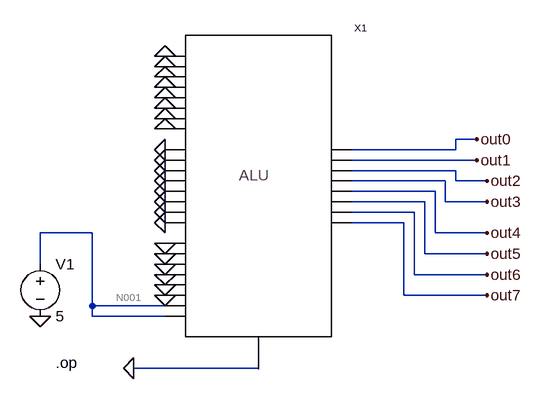
[diagram p0: schematic topEntity.asc]
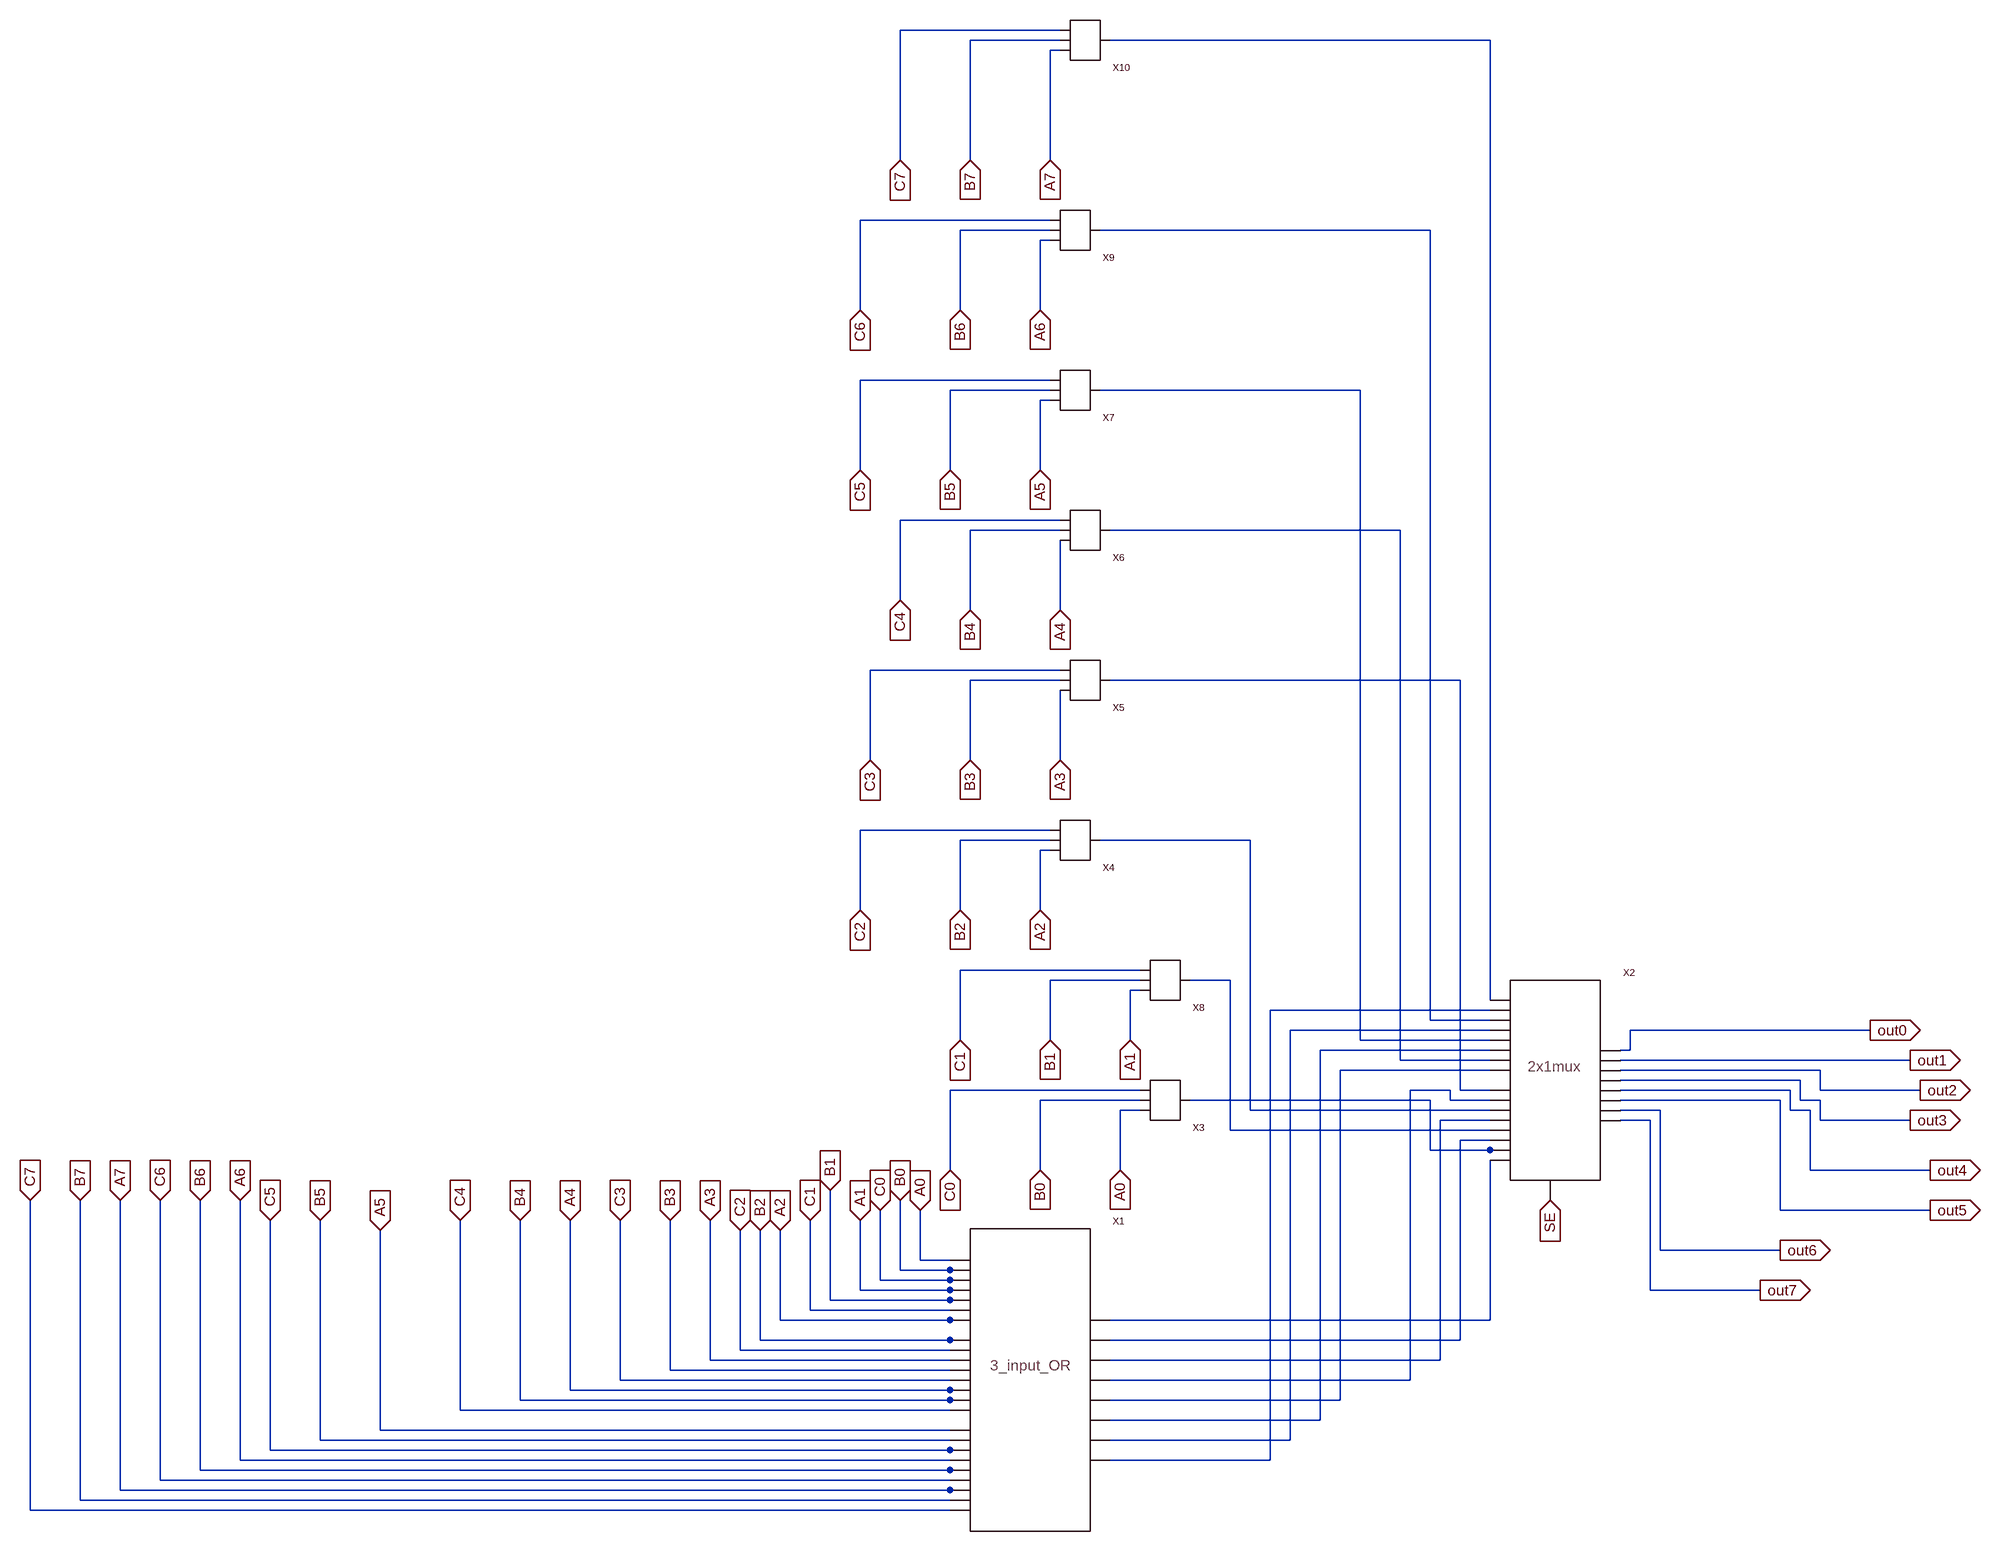
[diagram p1: sub-circuit alu.asc]
topEntity.asc, the LTspice schematic file:
Version 4
SHEET 1 880 680
WIRE 560 112 528 112
WIRE 528 128 528 112
WIRE 528 128 368 128
WIRE 560 144 368 144
WIRE 528 160 368 160
WIRE 512 176 368 176
WIRE 528 176 528 160
WIRE 576 176 528 176
WIRE 496 192 368 192
WIRE 480 208 368 208
WIRE 512 208 512 176
WIRE 576 208 512 208
WIRE 464 224 368 224
WIRE 448 240 368 240
WIRE -32 256 -112 256
WIRE 496 256 496 192
WIRE 576 256 496 256
WIRE 480 288 480 208
WIRE 576 288 480 288
WIRE -112 304 -112 256
WIRE 464 320 464 224
WIRE 576 320 464 320
WIRE 448 352 448 240
WIRE 576 352 448 352
WIRE -32 368 -32 256
WIRE 80 368 -32 368
WIRE -32 384 -32 368
WIRE 80 384 -32 384
WIRE 224 464 32 464
FLAG 80 -16 0
FLAG 80 0 0
FLAG 80 16 0
FLAG 80 32 0
FLAG 80 48 0
FLAG 80 64 0
FLAG 80 80 0
FLAG 80 96 0
FLAG 80 128 0
FLAG 80 144 0
FLAG 80 160 0
FLAG 80 176 0
FLAG 80 192 0
FLAG 80 208 0
FLAG 80 224 0
FLAG 80 240 0
FLAG 80 272 0
FLAG 80 288 0
FLAG 80 304 0
FLAG 80 320 0
FLAG 80 336 0
FLAG 80 352 0
FLAG -112 384 0
FLAG 560 112 out0
FLAG 560 144 out1
FLAG 576 176 out2
FLAG 576 208 out3
FLAG 576 256 out4
FLAG 576 288 out5
FLAG 576 320 out6
FLAG 576 352 out7
FLAG 32 464 0
SYMBOL ALU 544 160 R0
SYMATTR InstName X1
SYMBOL voltage -112 288 R0
SYMATTR InstName V1
SYMATTR Value 5
TEXT -88 456 Left 2 !.op

alu.asc, the sub-circuit schematic file:
Version 4
SHEET 1 1052 2052
WIRE -544 -592 -800 -592
WIRE -544 -576 -688 -576
WIRE 144 -576 -464 -576
WIRE -544 -560 -560 -560
WIRE -800 -384 -800 -592
WIRE -688 -384 -688 -576
WIRE -560 -384 -560 -560
WIRE -560 -288 -864 -288
WIRE -560 -272 -704 -272
WIRE 48 -272 -480 -272
WIRE -560 -256 -576 -256
WIRE -864 -144 -864 -288
WIRE -704 -144 -704 -272
WIRE -576 -144 -576 -256
WIRE -560 -32 -864 -32
WIRE -560 -16 -720 -16
WIRE -64 -16 -480 -16
WIRE -560 0 -576 0
WIRE -864 112 -864 -32
WIRE -720 112 -720 -16
WIRE -576 112 -576 0
WIRE -544 192 -800 192
WIRE -544 208 -688 208
WIRE 0 208 -464 208
WIRE -800 320 -800 192
WIRE -688 336 -688 208
WIRE -544 336 -544 224
WIRE -544 432 -848 432
WIRE -544 448 -688 448
WIRE 96 448 -464 448
WIRE -848 576 -848 432
WIRE -688 576 -688 448
WIRE -544 576 -544 464
WIRE -560 688 -864 688
WIRE -560 704 -704 704
WIRE -240 704 -480 704
WIRE -560 720 -576 720
WIRE -864 816 -864 688
WIRE -704 816 -704 704
WIRE -576 816 -576 720
WIRE -416 912 -704 912
WIRE -416 928 -560 928
WIRE -272 928 -336 928
WIRE -416 944 -432 944
WIRE 144 960 144 -576
WIRE 144 976 -208 976
WIRE 48 992 48 -272
WIRE 144 992 48 992
WIRE 144 1008 -176 1008
WIRE 752 1008 368 1008
WIRE -704 1024 -704 912
WIRE -560 1024 -560 928
WIRE -432 1024 -432 944
WIRE -64 1024 -64 -16
WIRE 144 1024 -64 1024
WIRE 144 1040 -128 1040
WIRE 368 1040 368 1008
WIRE 368 1040 352 1040
WIRE 0 1056 0 208
WIRE 144 1056 0 1056
WIRE 816 1056 352 1056
WIRE 144 1072 -96 1072
WIRE 672 1072 352 1072
WIRE 640 1088 352 1088
WIRE -416 1104 -720 1104
WIRE 80 1104 16 1104
WIRE 96 1104 96 448
WIRE 144 1104 96 1104
WIRE 624 1104 352 1104
WIRE 672 1104 672 1072
WIRE 832 1104 672 1104
WIRE -416 1120 -576 1120
WIRE 48 1120 -336 1120
WIRE 80 1120 80 1104
WIRE 144 1120 80 1120
WIRE 608 1120 352 1120
WIRE 640 1120 640 1088
WIRE 672 1120 640 1120
WIRE -416 1136 -448 1136
WIRE -240 1136 -240 704
WIRE 144 1136 -240 1136
WIRE 416 1136 352 1136
WIRE 624 1136 624 1104
WIRE 656 1136 624 1136
WIRE 144 1152 64 1152
WIRE 400 1152 352 1152
WIRE 672 1152 672 1120
WIRE 816 1152 672 1152
WIRE -272 1168 -272 928
WIRE 144 1168 -272 1168
WIRE 144 1184 96 1184
WIRE 48 1200 48 1120
WIRE 144 1200 48 1200
WIRE 160 1200 144 1200
WIRE -720 1232 -720 1104
WIRE -576 1232 -576 1120
WIRE -448 1232 -448 1136
WIRE 656 1232 656 1136
WIRE 848 1232 656 1232
WIRE 608 1296 608 1120
WIRE 848 1296 608 1296
WIRE 416 1360 416 1136
WIRE 608 1360 416 1360
WIRE -768 1376 -768 1296
WIRE -720 1376 -768 1376
WIRE -800 1392 -800 1280
WIRE -720 1392 -800 1392
WIRE -704 1392 -720 1392
WIRE -832 1408 -832 1296
WIRE -720 1408 -832 1408
WIRE -704 1408 -720 1408
WIRE -864 1424 -864 1312
WIRE -720 1424 -864 1424
WIRE -704 1424 -720 1424
WIRE 400 1424 400 1152
WIRE 576 1424 400 1424
WIRE -912 1440 -912 1264
WIRE -720 1440 -912 1440
WIRE -704 1440 -720 1440
WIRE -944 1456 -944 1312
WIRE -720 1456 -944 1456
WIRE -992 1472 -992 1328
WIRE -720 1472 -992 1472
WIRE -688 1472 -720 1472
WIRE 144 1472 144 1216
WIRE 144 1472 -464 1472
WIRE -1024 1504 -1024 1328
WIRE -720 1504 -1024 1504
WIRE -704 1504 -720 1504
WIRE 96 1504 96 1184
WIRE 96 1504 -464 1504
WIRE -1056 1520 -1056 1328
WIRE -720 1520 -1056 1520
WIRE -1104 1536 -1104 1312
WIRE -720 1536 -1104 1536
WIRE 64 1536 64 1152
WIRE 64 1536 -464 1536
WIRE -1168 1552 -1168 1312
WIRE -720 1552 -1168 1552
WIRE -1248 1568 -1248 1312
WIRE -720 1568 -1248 1568
WIRE 16 1568 16 1104
WIRE 16 1568 -464 1568
WIRE -1328 1584 -1328 1312
WIRE -720 1584 -1328 1584
WIRE -704 1584 -720 1584
WIRE -1408 1600 -1408 1312
WIRE -720 1600 -1408 1600
WIRE -704 1600 -720 1600
WIRE -96 1600 -96 1072
WIRE -96 1600 -464 1600
WIRE -1504 1616 -1504 1312
WIRE -720 1616 -1504 1616
WIRE -128 1632 -128 1040
WIRE -128 1632 -464 1632
WIRE -1632 1648 -1632 1328
WIRE -720 1648 -1632 1648
WIRE -1728 1664 -1728 1312
WIRE -720 1664 -1728 1664
WIRE -176 1664 -176 1008
WIRE -176 1664 -464 1664
WIRE -1808 1680 -1808 1312
WIRE -720 1680 -1808 1680
WIRE -704 1680 -720 1680
WIRE -1856 1696 -1856 1280
WIRE -720 1696 -1856 1696
WIRE -208 1696 -208 976
WIRE -208 1696 -464 1696
WIRE -1920 1712 -1920 1280
WIRE -720 1712 -1920 1712
WIRE -704 1712 -720 1712
WIRE -1984 1728 -1984 1280
WIRE -720 1728 -1984 1728
WIRE -2048 1744 -2048 1280
WIRE -720 1744 -2048 1744
WIRE -704 1744 -720 1744
WIRE -2112 1760 -2112 1280
WIRE -720 1760 -2112 1760
WIRE -2192 1776 -2192 1280
WIRE -720 1776 -2192 1776
FLAG -800 -384 C7
IOPIN -800 -384 In
FLAG -864 -144 C6
IOPIN -864 -144 In
FLAG -864 112 C5
IOPIN -864 112 In
FLAG -800 320 C4
IOPIN -800 320 In
FLAG -848 576 C3
IOPIN -848 576 In
FLAG -864 816 C2
IOPIN -864 816 In
FLAG -704 1024 C1
IOPIN -704 1024 In
FLAG -720 1232 C0
IOPIN -720 1232 In
FLAG -688 -384 B7
IOPIN -688 -384 In
FLAG -560 -384 A7
IOPIN -560 -384 In
FLAG -704 -144 B6
IOPIN -704 -144 In
FLAG -576 -144 A6
IOPIN -576 -144 In
FLAG -720 112 B5
IOPIN -720 112 In
FLAG -576 112 A5
IOPIN -576 112 In
FLAG -688 336 B4
IOPIN -688 336 In
FLAG -544 336 A4
IOPIN -544 336 In
FLAG -688 576 B3
IOPIN -688 576 In
FLAG -544 576 A3
IOPIN -544 576 In
FLAG -704 816 B2
IOPIN -704 816 In
FLAG -576 816 A2
IOPIN -576 816 In
FLAG -560 1024 B1
IOPIN -560 1024 In
FLAG -432 1024 A1
IOPIN -432 1024 In
FLAG -576 1232 B0
IOPIN -576 1232 In
FLAG -448 1232 A0
IOPIN -448 1232 In
FLAG -832 1296 C0
IOPIN -832 1296 In
FLAG -800 1280 B0
IOPIN -800 1280 In
FLAG -768 1296 A0
IOPIN -768 1296 In
FLAG -944 1312 C1
IOPIN -944 1312 In
FLAG -912 1264 B1
IOPIN -912 1264 In
FLAG -864 1312 A1
IOPIN -864 1312 In
FLAG -1056 1328 C2
IOPIN -1056 1328 In
FLAG -1024 1328 B2
IOPIN -1024 1328 In
FLAG -992 1328 A2
IOPIN -992 1328 In
FLAG -1248 1312 C3
IOPIN -1248 1312 In
FLAG -1168 1312 B3
IOPIN -1168 1312 In
FLAG -1104 1312 A3
IOPIN -1104 1312 In
FLAG -1504 1312 C4
IOPIN -1504 1312 In
FLAG -1408 1312 B4
IOPIN -1408 1312 In
FLAG -1328 1312 A4
IOPIN -1328 1312 In
FLAG -1808 1312 C5
IOPIN -1808 1312 In
FLAG -1728 1312 B5
IOPIN -1728 1312 In
FLAG -1632 1328 A5
IOPIN -1632 1328 In
FLAG -1984 1280 C6
IOPIN -1984 1280 In
FLAG -1920 1280 B6
IOPIN -1920 1280 In
FLAG -1856 1280 A6
IOPIN -1856 1280 In
FLAG -2192 1280 C7
IOPIN -2192 1280 In
FLAG -2112 1280 B7
IOPIN -2112 1280 In
FLAG -2048 1280 A7
IOPIN -2048 1280 In
FLAG 752 1008 out0
IOPIN 752 1008 Out
FLAG 816 1056 out1
IOPIN 816 1056 Out
FLAG 832 1104 out2
IOPIN 832 1104 Out
FLAG 816 1152 out3
IOPIN 816 1152 Out
FLAG 848 1232 out4
IOPIN 848 1232 Out
FLAG 848 1296 out5
IOPIN 848 1296 Out
FLAG 608 1360 out6
IOPIN 608 1360 Out
FLAG 576 1424 out7
IOPIN 576 1424 Out
FLAG 240 1280 SE
IOPIN 240 1280 In
SYMBOL MUX_8input 560 1104 R0
SYMATTR InstName X2
SYMBOL XOP_Part1 -304 1088 M180
SYMATTR InstName X3
SYMBOL XOP_Part1 -448 672 M180
SYMATTR InstName X4
SYMBOL XOP_Part1 -432 416 M180
SYMATTR InstName X5
SYMBOL XOP_Part1 -432 176 M180
SYMATTR InstName X6
SYMBOL XOP_Part1 -448 -48 M180
SYMATTR InstName X7
SYMBOL XOP_Part1 -304 896 M180
SYMATTR InstName X8
SYMBOL XOP_Part1 -448 -304 M180
SYMATTR InstName X9
SYMBOL XOP_Part1 -432 -608 M180
SYMATTR InstName X10
SYMBOL 8bit_OR -336 1472 R0
SYMATTR InstName X1

The netlist it stands for:
* topEntity.asc
XX1 0 0 0 0 0 0 0 0 0 0 0 0 0 0 0 N001 0 0 0 0 0 0 0 N001 out1 out0 out2 out3 out4 out5 out6 out7 0 alu
V1 N001 0 5

* block symbol definitions
.subckt alu A0 A1 A2 A3 A4 A5 A6 A7 B0 B1 B2 B3 B4 B5 B6 B7 C0 C1 C2 C3 C4 C5 C6 C7 out1 out0 out2 out3 out4 out5 out6 out7 SE
XX2 N001 N008 N002 N009 N003 N010 N004 N011 N005 N012 N006 N014 N007 N015 N013 N016 out0 out1 out2 out3 out4 out5 out6 out7 SE MUX_8input  ; pins in1 in2 in3 in4 in5 in6 in7 in8 in9 in10 in11 in12 in13 in14 in15 in16 y0 y1 y2 y3 y4 y5 y6 y7 s
XX3 A0 B0 C0 N013 XOP_Part1  ; pins A B C Y
XX4 A2 B2 C2 N006 XOP_Part1  ; pins A B C Y
XX5 A3 B3 C3 N005 XOP_Part1  ; pins A B C Y
XX6 A4 B4 C4 N004 XOP_Part1  ; pins A B C Y
XX7 A5 B5 C5 N003 XOP_Part1  ; pins A B C Y
XX8 A1 B1 C1 N007 XOP_Part1  ; pins A B C Y
XX9 A6 B6 C6 N002 XOP_Part1  ; pins A B C Y
XX10 A7 B7 C7 N001 XOP_Part1  ; pins A B C Y
XX1 A0 B0 C0 A1 B1 C1 A2 B2 C2 A3 B3 C3 A4 B4 C4 A5 B5 C5 A6 B6 C6 A7 B7 C7 N016 N015 N014 N012 N011 N010 N009 N008 8bit_OR  ; pins A0 B0 C0 A1 B1 C1 A2 B2 C2 A3 B3 C3 A4 B4 C4 A5 B5 C5 A6 B6 C6 A7 B7 C7 Y0 Y1 Y2 Y3 Y4 Y5 Y6 Y7
.ends alu

.op
.backanno
.end

* Results of the author's LTspice run, read from the files saved beside the schematic
* Operating Point:
*   V(out7) = 450.7 nV
*   V(out6) = 450.7 nV
*   V(out5) = 450.7 nV
*   V(out4) = 450.7 nV
*   V(out3) = 450.7 nV
*   V(out2) = 450.7 nV
*   V(out1) = 450.7 nV
*   V(out0) = 1.251 µV
*   V(n001) = 5 V
*   I(V1) = -40.04 pA
* From the log:
*   Semiconductor Device Operating Points:
*                           --- MOSFET Transistors ---
*   Name:      m:x1:x1:x8:7 m:x1:x1:x8:6 m:x1:x1:x8:5 m:x1:x1:x8:4 m:x1:x1:x7:7
*   Model:         nmos         nmos         nmos         nmos         nmos
*   Id:          1.00e-11     5.98e-20     2.50e-12     2.50e-12     1.50e-11
*   Vgs:         2.50e-08     0.00e+00     5.00e+00     5.00e+00     5.00e+00
*   Vds:         5.00e+00     2.50e-08     2.50e-08     2.50e-08     1.50e-07
*   Vbs:         0.00e+00     0.00e+00     0.00e+00     0.00e+00     0.00e+00
*   Vth:         0.00e+00     0.00e+00     0.00e+00     0.00e+00     0.00e+00
*   Vdsat:       2.50e-08     0.00e+00     5.00e+00     5.00e+00     5.00e+00
*   Gm:          5.01e-13     0.00e+00     5.01e-13     5.01e-13     3.00e-12
*   Gds:         0.00e+00     0.00e+00     1.00e-04     1.00e-04     1.00e-04
*   Gmb:         0.00e+00     0.00e+00     0.00e+00     0.00e+00     0.00e+00
*   Cbd:         0.00e+00     0.00e+00     0.00e+00     0.00e+00     0.00e+00
*   Cbs:         0.00e+00     0.00e+00     0.00e+00     0.00e+00     0.00e+00
*   Cgsov:       0.00e+00     0.00e+00     0.00e+00     0.00e+00     0.00e+00
*   Cgdov:       0.00e+00     0.00e+00     0.00e+00     0.00e+00     0.00e+00
*   Cgbov:       0.00e+00     0.00e+00     0.00e+00     0.00e+00     0.00e+00
*   Cgs:         0.00e+00     0.00e+00     0.00e+00     0.00e+00     0.00e+00
*   Cgd:         0.00e+00     0.00e+00     0.00e+00     0.00e+00     0.00e+00
*   Cgb:         0.00e+00    -0.00e+00     0.00e+00     0.00e+00     0.00e+00
*   Name:      m:x1:x1:x7:6 m:x1:x1:x7:5 m:x1:x1:x7:4 m:x1:x1:x6:7 m:x1:x1:x6:6
*   Model:         nmos         nmos         nmos         nmos         nmos
*   Id:          1.00e-11     1.00e-11     1.00e-11     1.50e-11     1.00e-11
*   Vgs:         0.00e+00     0.00e+00     0.00e+00     5.00e+00     0.00e+00
*   Vds:         5.00e+00     5.00e+00     5.00e+00     1.50e-07     5.00e+00
*   Vbs:         0.00e+00     0.00e+00     0.00e+00     0.00e+00     0.00e+00
*   Vth:         0.00e+00     0.00e+00     0.00e+00     0.00e+00     0.00e+00
*   Vdsat:       0.00e+00     0.00e+00     0.00e+00     5.00e+00     0.00e+00
*   Gm:          0.00e+00     0.00e+00     0.00e+00     3.00e-12     0.00e+00
*   Gds:         0.00e+00     0.00e+00     0.00e+00     1.00e-04     0.00e+00
*   Gmb:         0.00e+00     0.00e+00     0.00e+00     0.00e+00     0.00e+00
*   Cbd:         0.00e+00     0.00e+00     0.00e+00     0.00e+00     0.00e+00
*   Cbs:         0.00e+00     0.00e+00     0.00e+00     0.00e+00     0.00e+00
*   Cgsov:       0.00e+00     0.00e+00     0.00e+00     0.00e+00     0.00e+00
*   Cgdov:       0.00e+00     0.00e+00     0.00e+00     0.00e+00     0.00e+00
*   Cgbov:       0.00e+00     0.00e+00     0.00e+00     0.00e+00     0.00e+00
*   Cgs:         0.00e+00     0.00e+00     0.00e+00     0.00e+00     0.00e+00
*   Cgd:         0.00e+00     0.00e+00     0.00e+00     0.00e+00     0.00e+00
*   Cgb:        -0.00e+00    -0.00e+00    -0.00e+00     0.00e+00    -0.00e+00
*   Name:      m:x1:x1:x6:5 m:x1:x1:x6:4 m:x1:x1:x5:7 m:x1:x1:x5:6 m:x1:x1:x5:5
*   Model:         nmos         nmos         nmos         nmos         nmos
*   Id:          1.00e-11     1.00e-11     1.50e-11     1.00e-11     1.00e-11
*   Vgs:         0.00e+00     0.00e+00     5.00e+00     0.00e+00     0.00e+00
*   Vds:         5.00e+00     5.00e+00     1.50e-07     5.00e+00     5.00e+00
*   Vbs:         0.00e+00     0.00e+00     0.00e+00     0.00e+00     0.00e+00
*   Vth:         0.00e+00     0.00e+00     0.00e+00     0.00e+00     0.00e+00
*   Vdsat:       0.00e+00     0.00e+00     5.00e+00     0.00e+00     0.00e+00
*   Gm:          0.00e+00     0.00e+00     3.00e-12     0.00e+00     0.00e+00
*   Gds:         0.00e+00     0.00e+00     1.00e-04     0.00e+00     0.00e+00
*   Gmb:         0.00e+00     0.00e+00     0.00e+00     0.00e+00     0.00e+00
*   Cbd:         0.00e+00     0.00e+00     0.00e+00     0.00e+00     0.00e+00
*   Cbs:         0.00e+00     0.00e+00     0.00e+00     0.00e+00     0.00e+00
*   Cgsov:       0.00e+00     0.00e+00     0.00e+00     0.00e+00     0.00e+00
*   Cgdov:       0.00e+00     0.00e+00     0.00e+00     0.00e+00     0.00e+00
*   Cgbov:       0.00e+00     0.00e+00     0.00e+00     0.00e+00     0.00e+00
*   Cgs:         0.00e+00     0.00e+00     0.00e+00     0.00e+00     0.00e+00
*   Cgd:         0.00e+00     0.00e+00     0.00e+00     0.00e+00     0.00e+00
*   Cgb:        -0.00e+00    -0.00e+00     0.00e+00    -0.00e+00    -0.00e+00
*   Name:      m:x1:x1:x5:4 m:x1:x1:x4:7 m:x1:x1:x4:6 m:x1:x1:x4:5 m:x1:x1:x4:4
*   Model:         nmos         nmos         nmos         nmos         nmos
*   Id:          1.00e-11     1.50e-11     1.00e-11     1.00e-11     1.00e-11
*   Vgs:         0.00e+00     5.00e+00     0.00e+00     0.00e+00     0.00e+00
*   Vds:         5.00e+00     1.50e-07     5.00e+00     5.00e+00     5.00e+00
*   Vbs:         0.00e+00     0.00e+00     0.00e+00     0.00e+00     0.00e+00
*   Vth:         0.00e+00     0.00e+00     0.00e+00     0.00e+00     0.00e+00
*   Vdsat:       0.00e+00     5.00e+00     0.00e+00     0.00e+00     0.00e+00
*   Gm:          0.00e+00     3.00e-12     0.00e+00     0.00e+00     0.00e+00
*   Gds:         0.00e+00     1.00e-04     0.00e+00     0.00e+00     0.00e+00
*   Gmb:         0.00e+00     0.00e+00     0.00e+00     0.00e+00     0.00e+00
*   Cbd:         0.00e+00     0.00e+00     0.00e+00     0.00e+00     0.00e+00
*   Cbs:         0.00e+00     0.00e+00     0.00e+00     0.00e+00     0.00e+00
*   Cgsov:       0.00e+00     0.00e+00     0.00e+00     0.00e+00     0.00e+00
*   Cgdov:       0.00e+00     0.00e+00     0.00e+00     0.00e+00     0.00e+00
*   Cgbov:       0.00e+00     0.00e+00     0.00e+00     0.00e+00     0.00e+00
*   Cgs:         0.00e+00     0.00e+00     0.00e+00     0.00e+00     0.00e+00
*   Cgd:         0.00e+00     0.00e+00     0.00e+00     0.00e+00     0.00e+00
*   Cgb:        -0.00e+00     0.00e+00    -0.00e+00    -0.00e+00    -0.00e+00
*   Name:      m:x1:x1:x3:7 m:x1:x1:x3:6 m:x1:x1:x3:5 m:x1:x1:x3:4 m:x1:x1:x2:7
*   Model:         nmos         nmos         nmos         nmos         nmos
*   Id:          1.50e-11     1.00e-11     1.00e-11     1.00e-11     1.50e-11
*   Vgs:         5.00e+00     0.00e+00     0.00e+00     0.00e+00     5.00e+00
*   Vds:         1.50e-07     5.00e+00     5.00e+00     5.00e+00     1.50e-07
*   Vbs:         0.00e+00     0.00e+00     0.00e+00     0.00e+00     0.00e+00
*   Vth:         0.00e+00     0.00e+00     0.00e+00     0.00e+00     0.00e+00
*   Vdsat:       5.00e+00     0.00e+00     0.00e+00     0.00e+00     5.00e+00
*   Gm:          3.00e-12     0.00e+00     0.00e+00     0.00e+00     3.00e-12
*   Gds:         1.00e-04     0.00e+00     0.00e+00     0.00e+00     1.00e-04
*   Gmb:         0.00e+00     0.00e+00     0.00e+00     0.00e+00     0.00e+00
*   Cbd:         0.00e+00     0.00e+00     0.00e+00     0.00e+00     0.00e+00
*   Cbs:         0.00e+00     0.00e+00     0.00e+00     0.00e+00     0.00e+00
*   Cgsov:       0.00e+00     0.00e+00     0.00e+00     0.00e+00     0.00e+00
*   Cgdov:       0.00e+00     0.00e+00     0.00e+00     0.00e+00     0.00e+00
*   Cgbov:       0.00e+00     0.00e+00     0.00e+00     0.00e+00     0.00e+00
*   Cgs:         0.00e+00     0.00e+00     0.00e+00     0.00e+00     0.00e+00
*   Cgd:         0.00e+00     0.00e+00     0.00e+00     0.00e+00     0.00e+00
*   Cgb:         0.00e+00    -0.00e+00    -0.00e+00    -0.00e+00     0.00e+00
*   Name:      m:x1:x1:x2:6 m:x1:x1:x2:5 m:x1:x1:x2:4 m:x1:x1:x1:7 m:x1:x1:x1:6
*   Model:         nmos         nmos         nmos         nmos         nmos
*   Id:          1.00e-11     1.00e-11     1.00e-11     1.50e-11     1.00e-11
*   Vgs:         0.00e+00     0.00e+00     0.00e+00     5.00e+00     0.00e+00
*   Vds:         5.00e+00     5.00e+00     5.00e+00     1.50e-07     5.00e+00
*   Vbs:         0.00e+00     0.00e+00     0.00e+00     0.00e+00     0.00e+00
*   Vth:         0.00e+00     0.00e+00     0.00e+00     0.00e+00     0.00e+00
*   Vdsat:       0.00e+00     0.00e+00     0.00e+00     5.00e+00     0.00e+00
*   Gm:          0.00e+00     0.00e+00     0.00e+00     3.00e-12     0.00e+00
*   Gds:         0.00e+00     0.00e+00     0.00e+00     1.00e-04     0.00e+00
*   Gmb:         0.00e+00     0.00e+00     0.00e+00     0.00e+00     0.00e+00
*   Cbd:         0.00e+00     0.00e+00     0.00e+00     0.00e+00     0.00e+00
*   Cbs:         0.00e+00     0.00e+00     0.00e+00     0.00e+00     0.00e+00
*   Cgsov:       0.00e+00     0.00e+00     0.00e+00     0.00e+00     0.00e+00
*   Cgdov:       0.00e+00     0.00e+00     0.00e+00     0.00e+00     0.00e+00
*   Cgbov:       0.00e+00     0.00e+00     0.00e+00     0.00e+00     0.00e+00
*   Cgs:         0.00e+00     0.00e+00     0.00e+00     0.00e+00     0.00e+00
*   Cgd:         0.00e+00     0.00e+00     0.00e+00     0.00e+00     0.00e+00
*   Cgb:        -0.00e+00    -0.00e+00    -0.00e+00     0.00e+00    -0.00e+00
*   Name:      m:x1:x1:x1:5 m:x1:x1:x1:4 m:x1:x10:16 m:x1:x10:15 m:x1:x10:11
*   Model:         nmos         nmos        nmos        nmos        nmos
*   Id:          1.00e-11     1.00e-11    -4.50e-11    1.00e-11    6.01e-11
*   Vgs:         0.00e+00     0.00e+00     5.00e+00   -9.51e-07    5.00e+00
*   Vds:         5.00e+00     5.00e+00    -4.50e-07    5.00e+00    6.01e-07
*   Vbs:         0.00e+00     0.00e+00    -1.05e-06   -1.05e-06    0.00e+00
*   Vth:         0.00e+00     0.00e+00     0.00e+00    0.00e+00    0.00e+00
*   Vdsat:       0.00e+00     0.00e+00     5.00e+00    0.00e+00    5.00e+00
*   Gm:          0.00e+00     0.00e+00     9.01e-12    0.00e+00    1.20e-11
*   Gds:         0.00e+00     0.00e+00     1.00e-04    0.00e+00    1.00e-04
*   Gmb:         0.00e+00     0.00e+00     0.00e+00    0.00e+00    0.00e+00
*   Cbd:         0.00e+00     0.00e+00     0.00e+00    0.00e+00    0.00e+00
*   Cbs:         0.00e+00     0.00e+00     0.00e+00    0.00e+00    0.00e+00
*   Cgsov:       0.00e+00     0.00e+00     0.00e+00    0.00e+00    0.00e+00
*   Cgdov:       0.00e+00     0.00e+00     0.00e+00    0.00e+00    0.00e+00
*   Cgbov:       0.00e+00     0.00e+00     0.00e+00    0.00e+00    0.00e+00
*   Cgs:         0.00e+00     0.00e+00     0.00e+00    0.00e+00    0.00e+00
*   Cgd:         0.00e+00     0.00e+00     0.00e+00    0.00e+00    0.00e+00
*   Cgb:        -0.00e+00    -0.00e+00     0.00e+00    0.00e+00    0.00e+00
*   Name:      m:x1:x10:8  m:x1:x10:9  m:x1:x10:6  m:x1:x10:3  m:x1:x10:1
*   Model:        nmos        nmos        nmos        nmos        nmos
*   Id:          1.00e-11   -5.00e-12    5.01e-12    2.50e-11    1.00e-11
*   Vgs:         5.00e+00   -5.00e+00    1.00e-07    5.00e+00    0.00e+00
*   Vds:         1.00e-07   -5.00e+00    2.00e-07    2.50e-07    5.00e+00
*   Vbs:         0.00e+00   -5.00e+00   -5.00e+00    0.00e+00    0.00e+00
*   Vth:         0.00e+00    0.00e+00    0.00e+00    0.00e+00    0.00e+00
*   Vdsat:       5.00e+00    0.00e+00    1.00e-07    5.00e+00    0.00e+00
*   Gm:          2.00e-12    0.00e+00    2.00e-12    5.00e-12    0.00e+00
*   Gds:         1.00e-04    0.00e+00    0.00e+00    1.00e-04    0.00e+00
*   Gmb:         0.00e+00    0.00e+00    0.00e+00    0.00e+00    0.00e+00
*   Cbd:         0.00e+00    0.00e+00    0.00e+00    0.00e+00    0.00e+00
*   Cbs:         0.00e+00    0.00e+00    0.00e+00    0.00e+00    0.00e+00
*   Cgsov:       0.00e+00    0.00e+00    0.00e+00    0.00e+00    0.00e+00
*   Cgdov:       0.00e+00    0.00e+00    0.00e+00    0.00e+00    0.00e+00
*   Cgbov:       0.00e+00    0.00e+00    0.00e+00    0.00e+00    0.00e+00
*   Cgs:         0.00e+00    0.00e+00    0.00e+00    0.00e+00    0.00e+00
*   Cgd:         0.00e+00    0.00e+00    0.00e+00    0.00e+00    0.00e+00
*   Cgb:         0.00e+00    0.00e+00    0.00e+00    0.00e+00   -0.00e+00
*   Name:      m:x1:x9:16  m:x1:x9:15  m:x1:x9:11   m:x1:x9:8   m:x1:x9:9
*   Model:        nmos        nmos        nmos        nmos        nmos
*   Id:          1.00e-11   -3.50e-11    1.00e-11    1.00e-11    1.00e-11
*   Vgs:        -1.50e-07    5.00e+00    0.00e+00    2.00e-07   -2.00e-07
*   Vds:         5.00e+00   -3.50e-07    5.00e+00    5.00e+00    5.00e+00
*   Vbs:        -3.50e-07   -3.50e-07    0.00e+00    0.00e+00   -2.00e-07
*   Vth:         0.00e+00    0.00e+00    0.00e+00    0.00e+00    0.00e+00
*   Vdsat:       0.00e+00    5.00e+00    0.00e+00    2.00e-07    0.00e+00
*   Gm:          0.00e+00    7.01e-12    0.00e+00    4.00e-12    0.00e+00
*   Gds:         0.00e+00    1.00e-04    0.00e+00    0.00e+00    0.00e+00
*   Gmb:         0.00e+00    0.00e+00    0.00e+00    0.00e+00    0.00e+00
*   Cbd:         0.00e+00    0.00e+00    0.00e+00    0.00e+00    0.00e+00
*   Cbs:         0.00e+00    0.00e+00    0.00e+00    0.00e+00    0.00e+00
*   Cgsov:       0.00e+00    0.00e+00    0.00e+00    0.00e+00    0.00e+00
*   Cgdov:       0.00e+00    0.00e+00    0.00e+00    0.00e+00    0.00e+00
*   Cgbov:       0.00e+00    0.00e+00    0.00e+00    0.00e+00    0.00e+00
*   Cgs:         0.00e+00    0.00e+00    0.00e+00    0.00e+00    0.00e+00
*   Cgd:         0.00e+00    0.00e+00    0.00e+00    0.00e+00    0.00e+00
*   Cgb:         0.00e+00    0.00e+00   -0.00e+00    0.00e+00    0.00e+00
*   Name:       m:x1:x9:6   m:x1:x9:3   m:x1:x9:1  m:x1:x8:16  m:x1:x8:15
*   Model:        nmos        nmos        nmos        nmos        nmos
*   Id:         -2.00e-11    1.00e-11    1.00e-11    1.00e-11   -3.50e-11
*   Vgs:         5.00e+00    0.00e+00    0.00e+00   -1.50e-07    5.00e+00
*   Vds:        -2.00e-07    5.00e+00    5.00e+00    5.00e+00   -3.50e-07
*   Vbs:        -2.00e-07    0.00e+00    0.00e+00   -3.50e-07   -3.50e-07
*   Vth:         0.00e+00    0.00e+00    0.00e+00    0.00e+00    0.00e+00
*   Vdsat:       5.00e+00    0.00e+00    0.00e+00    0.00e+00    5.00e+00
*   Gm:          4.00e-12    0.00e+00    0.00e+00    0.00e+00    7.01e-12
*   Gds:         1.00e-04    0.00e+00    0.00e+00    0.00e+00    1.00e-04
*   Gmb:         0.00e+00    0.00e+00    0.00e+00    0.00e+00    0.00e+00
*   Cbd:         0.00e+00    0.00e+00    0.00e+00    0.00e+00    0.00e+00
*   Cbs:         0.00e+00    0.00e+00    0.00e+00    0.00e+00    0.00e+00
*   Cgsov:       0.00e+00    0.00e+00    0.00e+00    0.00e+00    0.00e+00
*   Cgdov:       0.00e+00    0.00e+00    0.00e+00    0.00e+00    0.00e+00
*   Cgbov:       0.00e+00    0.00e+00    0.00e+00    0.00e+00    0.00e+00
*   Cgs:         0.00e+00    0.00e+00    0.00e+00    0.00e+00    0.00e+00
*   Cgd:         0.00e+00    0.00e+00    0.00e+00    0.00e+00    0.00e+00
*   Cgb:         0.00e+00   -0.00e+00   -0.00e+00    0.00e+00    0.00e+00
*   Name:      m:x1:x8:11   m:x1:x8:8   m:x1:x8:9   m:x1:x8:6   m:x1:x8:3
*   Model:        nmos        nmos        nmos        nmos        nmos
*   Id:          1.00e-11    1.00e-11    1.00e-11   -2.00e-11    1.00e-11
*   Vgs:         0.00e+00    2.00e-07   -2.00e-07    5.00e+00    0.00e+00
*   Vds:         5.00e+00    5.00e+00    5.00e+00   -2.00e-07    5.00e+00
*   Vbs:         0.00e+00    0.00e+00   -2.00e-07   -2.00e-07    0.00e+00
*   Vth:         0.00e+00    0.00e+00    0.00e+00    0.00e+00    0.00e+00
*   Vdsat:       0.00e+00    2.00e-07    0.00e+00    5.00e+00    0.00e+00
*   Gm:          0.00e+00    4.00e-12    0.00e+00    4.00e-12    0.00e+00
*   Gds:         0.00e+00    0.00e+00    0.00e+00    1.00e-04    0.00e+00
*   Gmb:         0.00e+00    0.00e+00    0.00e+00    0.00e+00    0.00e+00
*   Cbd:         0.00e+00    0.00e+00    0.00e+00    0.00e+00    0.00e+00
*   Cbs:         0.00e+00    0.00e+00    0.00e+00    0.00e+00    0.00e+00
*   Cgsov:       0.00e+00    0.00e+00    0.00e+00    0.00e+00    0.00e+00
*   Cgdov:       0.00e+00    0.00e+00    0.00e+00    0.00e+00    0.00e+00
*   Cgbov:       0.00e+00    0.00e+00    0.00e+00    0.00e+00    0.00e+00
*   Cgs:         0.00e+00    0.00e+00    0.00e+00    0.00e+00    0.00e+00
*   Cgd:         0.00e+00    0.00e+00    0.00e+00    0.00e+00    0.00e+00
*   Cgb:        -0.00e+00    0.00e+00    0.00e+00    0.00e+00   -0.00e+00
*   Name:       m:x1:x8:1  m:x1:x7:16  m:x1:x7:15  m:x1:x7:11   m:x1:x7:8
*   Model:        nmos        nmos        nmos        nmos        nmos
*   Id:          1.00e-11    1.00e-11   -3.50e-11    1.00e-11    1.00e-11
*   Vgs:         0.00e+00   -1.50e-07    5.00e+00    0.00e+00    2.00e-07
*   Vds:         5.00e+00    5.00e+00   -3.50e-07    5.00e+00    5.00e+00
*   Vbs:         0.00e+00   -3.50e-07   -3.50e-07    0.00e+00    0.00e+00
*   Vth:         0.00e+00    0.00e+00    0.00e+00    0.00e+00    0.00e+00
*   Vdsat:       0.00e+00    0.00e+00    5.00e+00    0.00e+00    2.00e-07
*   Gm:          0.00e+00    0.00e+00    7.01e-12    0.00e+00    4.00e-12
*   Gds:         0.00e+00    0.00e+00    1.00e-04    0.00e+00    0.00e+00
*   Gmb:         0.00e+00    0.00e+00    0.00e+00    0.00e+00    0.00e+00
*   Cbd:         0.00e+00    0.00e+00    0.00e+00    0.00e+00    0.00e+00
*   Cbs:         0.00e+00    0.00e+00    0.00e+00    0.00e+00    0.00e+00
*   Cgsov:       0.00e+00    0.00e+00    0.00e+00    0.00e+00    0.00e+00
*   Cgdov:       0.00e+00    0.00e+00    0.00e+00    0.00e+00    0.00e+00
*   Cgbov:       0.00e+00    0.00e+00    0.00e+00    0.00e+00    0.00e+00
*   Cgs:         0.00e+00    0.00e+00    0.00e+00    0.00e+00    0.00e+00
*   Cgd:         0.00e+00    0.00e+00    0.00e+00    0.00e+00    0.00e+00
*   Cgb:        -0.00e+00    0.00e+00    0.00e+00   -0.00e+00    0.00e+00
*   Name:       m:x1:x7:9   m:x1:x7:6   m:x1:x7:3   m:x1:x7:1  m:x1:x6:16
*   Model:        nmos        nmos        nmos        nmos        nmos
*   Id:          1.00e-11   -2.00e-11    1.00e-11    1.00e-11    1.00e-11
*   Vgs:        -2.00e-07    5.00e+00    0.00e+00    0.00e+00   -1.50e-07
*   Vds:         5.00e+00   -2.00e-07    5.00e+00    5.00e+00    5.00e+00
*   Vbs:        -2.00e-07   -2.00e-07    0.00e+00    0.00e+00   -3.50e-07
*   Vth:         0.00e+00    0.00e+00    0.00e+00    0.00e+00    0.00e+00
*   Vdsat:       0.00e+00    5.00e+00    0.00e+00    0.00e+00    0.00e+00
*   Gm:          0.00e+00    4.00e-12    0.00e+00    0.00e+00    0.00e+00
*   Gds:         0.00e+00    1.00e-04    0.00e+00    0.00e+00    0.00e+00
*   Gmb:         0.00e+00    0.00e+00    0.00e+00    0.00e+00    0.00e+00
*   Cbd:         0.00e+00    0.00e+00    0.00e+00    0.00e+00    0.00e+00
*   Cbs:         0.00e+00    0.00e+00    0.00e+00    0.00e+00    0.00e+00
*   Cgsov:       0.00e+00    0.00e+00    0.00e+00    0.00e+00    0.00e+00
*   Cgdov:       0.00e+00    0.00e+00    0.00e+00    0.00e+00    0.00e+00
*   Cgbov:       0.00e+00    0.00e+00    0.00e+00    0.00e+00    0.00e+00
*   Cgs:         0.00e+00    0.00e+00    0.00e+00    0.00e+00    0.00e+00
*   Cgd:         0.00e+00    0.00e+00    0.00e+00    0.00e+00    0.00e+00
*   Cgb:         0.00e+00    0.00e+00   -0.00e+00   -0.00e+00    0.00e+00
*   Name:      m:x1:x6:15  m:x1:x6:11   m:x1:x6:8   m:x1:x6:9   m:x1:x6:6
*   Model:        nmos        nmos        nmos        nmos        nmos
*   Id:         -3.50e-11    1.00e-11    1.00e-11    1.00e-11   -2.00e-11
*   Vgs:         5.00e+00    0.00e+00    2.00e-07   -2.00e-07    5.00e+00
*   Vds:        -3.50e-07    5.00e+00    5.00e+00    5.00e+00   -2.00e-07
*   Vbs:        -3.50e-07    0.00e+00    0.00e+00   -2.00e-07   -2.00e-07
*   Vth:         0.00e+00    0.00e+00    0.00e+00    0.00e+00    0.00e+00
*   Vdsat:       5.00e+00    0.00e+00    2.00e-07    0.00e+00    5.00e+00
*   Gm:          7.01e-12    0.00e+00    4.00e-12    0.00e+00    4.00e-12
*   Gds:         1.00e-04    0.00e+00    0.00e+00    0.00e+00    1.00e-04
*   Gmb:         0.00e+00    0.00e+00    0.00e+00    0.00e+00    0.00e+00
*   Cbd:         0.00e+00    0.00e+00    0.00e+00    0.00e+00    0.00e+00
*   Cbs:         0.00e+00    0.00e+00    0.00e+00    0.00e+00    0.00e+00
*   Cgsov:       0.00e+00    0.00e+00    0.00e+00    0.00e+00    0.00e+00
*   Cgdov:       0.00e+00    0.00e+00    0.00e+00    0.00e+00    0.00e+00
*   Cgbov:       0.00e+00    0.00e+00    0.00e+00    0.00e+00    0.00e+00
*   Cgs:         0.00e+00    0.00e+00    0.00e+00    0.00e+00    0.00e+00
*   Cgd:         0.00e+00    0.00e+00    0.00e+00    0.00e+00    0.00e+00
*   Cgb:         0.00e+00   -0.00e+00    0.00e+00    0.00e+00    0.00e+00
*   Name:       m:x1:x6:3   m:x1:x6:1  m:x1:x5:16  m:x1:x5:15  m:x1:x5:11
*   Model:        nmos        nmos        nmos        nmos        nmos
*   Id:          1.00e-11    1.00e-11    1.00e-11   -3.50e-11    1.00e-11
*   Vgs:         0.00e+00    0.00e+00   -1.50e-07    5.00e+00    0.00e+00
*   Vds:         5.00e+00    5.00e+00    5.00e+00   -3.50e-07    5.00e+00
*   Vbs:         0.00e+00    0.00e+00   -3.50e-07   -3.50e-07    0.00e+00
*   Vth:         0.00e+00    0.00e+00    0.00e+00    0.00e+00    0.00e+00
*   Vdsat:       0.00e+00    0.00e+00    0.00e+00    5.00e+00    0.00e+00
*   Gm:          0.00e+00    0.00e+00    0.00e+00    7.01e-12    0.00e+00
*   Gds:         0.00e+00    0.00e+00    0.00e+00    1.00e-04    0.00e+00
*   Gmb:         0.00e+00    0.00e+00    0.00e+00    0.00e+00    0.00e+00
*   Cbd:         0.00e+00    0.00e+00    0.00e+00    0.00e+00    0.00e+00
*   Cbs:         0.00e+00    0.00e+00    0.00e+00    0.00e+00    0.00e+00
*   Cgsov:       0.00e+00    0.00e+00    0.00e+00    0.00e+00    0.00e+00
*   Cgdov:       0.00e+00    0.00e+00    0.00e+00    0.00e+00    0.00e+00
*   Cgbov:       0.00e+00    0.00e+00    0.00e+00    0.00e+00    0.00e+00
*   Cgs:         0.00e+00    0.00e+00    0.00e+00    0.00e+00    0.00e+00
*   Cgd:         0.00e+00    0.00e+00    0.00e+00    0.00e+00    0.00e+00
*   Cgb:        -0.00e+00   -0.00e+00    0.00e+00    0.00e+00   -0.00e+00
*   Name:       m:x1:x5:8   m:x1:x5:9   m:x1:x5:6   m:x1:x5:3   m:x1:x5:1
*   Model:        nmos        nmos        nmos        nmos        nmos
*   Id:          1.00e-11    1.00e-11   -2.00e-11    1.00e-11    1.00e-11
*   Vgs:         2.00e-07   -2.00e-07    5.00e+00    0.00e+00    0.00e+00
*   Vds:         5.00e+00    5.00e+00   -2.00e-07    5.00e+00    5.00e+00
*   Vbs:         0.00e+00   -2.00e-07   -2.00e-07    0.00e+00    0.00e+00
*   Vth:         0.00e+00    0.00e+00    0.00e+00    0.00e+00    0.00e+00
*   Vdsat:       2.00e-07    0.00e+00    5.00e+00    0.00e+00    0.00e+00
*   Gm:          4.00e-12    0.00e+00    4.00e-12    0.00e+00    0.00e+00
*   Gds:         0.00e+00    0.00e+00    1.00e-04    0.00e+00    0.00e+00
*   Gmb:         0.00e+00    0.00e+00    0.00e+00    0.00e+00    0.00e+00
*   Cbd:         0.00e+00    0.00e+00    0.00e+00    0.00e+00    0.00e+00
*   Cbs:         0.00e+00    0.00e+00    0.00e+00    0.00e+00    0.00e+00
*   Cgsov:       0.00e+00    0.00e+00    0.00e+00    0.00e+00    0.00e+00
*   Cgdov:       0.00e+00    0.00e+00    0.00e+00    0.00e+00    0.00e+00
*   Cgbov:       0.00e+00    0.00e+00    0.00e+00    0.00e+00    0.00e+00
*   Cgs:         0.00e+00    0.00e+00    0.00e+00    0.00e+00    0.00e+00
*   Cgd:         0.00e+00    0.00e+00    0.00e+00    0.00e+00    0.00e+00
*   Cgb:         0.00e+00    0.00e+00    0.00e+00   -0.00e+00   -0.00e+00
*   Name:      m:x1:x4:16  m:x1:x4:15  m:x1:x4:11   m:x1:x4:8   m:x1:x4:9
*   Model:        nmos        nmos        nmos        nmos        nmos
*   Id:          1.00e-11   -3.50e-11    1.00e-11    1.00e-11    1.00e-11
*   Vgs:        -1.50e-07    5.00e+00    0.00e+00    2.00e-07   -2.00e-07
*   Vds:         5.00e+00   -3.50e-07    5.00e+00    5.00e+00    5.00e+00
*   Vbs:        -3.50e-07   -3.50e-07    0.00e+00    0.00e+00   -2.00e-07
*   Vth:         0.00e+00    0.00e+00    0.00e+00    0.00e+00    0.00e+00
*   Vdsat:       0.00e+00    5.00e+00    0.00e+00    2.00e-07    0.00e+00
*   Gm:          0.00e+00    7.01e-12    0.00e+00    4.00e-12    0.00e+00
*   Gds:         0.00e+00    1.00e-04    0.00e+00    0.00e+00    0.00e+00
*   Gmb:         0.00e+00    0.00e+00    0.00e+00    0.00e+00    0.00e+00
*   Cbd:         0.00e+00    0.00e+00    0.00e+00    0.00e+00    0.00e+00
*   Cbs:         0.00e+00    0.00e+00    0.00e+00    0.00e+00    0.00e+00
*   Cgsov:       0.00e+00    0.00e+00    0.00e+00    0.00e+00    0.00e+00
*   Cgdov:       0.00e+00    0.00e+00    0.00e+00    0.00e+00    0.00e+00
*   Cgbov:       0.00e+00    0.00e+00    0.00e+00    0.00e+00    0.00e+00
*   Cgs:         0.00e+00    0.00e+00    0.00e+00    0.00e+00    0.00e+00
*   Cgd:         0.00e+00    0.00e+00    0.00e+00    0.00e+00    0.00e+00
*   Cgb:         0.00e+00    0.00e+00   -0.00e+00    0.00e+00    0.00e+00
*   Name:       m:x1:x4:6   m:x1:x4:3   m:x1:x4:1  m:x1:x3:16  m:x1:x3:15
*   Model:        nmos        nmos        nmos        nmos        nmos
*   Id:         -2.00e-11    1.00e-11    1.00e-11    1.00e-11   -3.50e-11
*   Vgs:         5.00e+00    0.00e+00    0.00e+00   -1.50e-07    5.00e+00
*   Vds:        -2.00e-07    5.00e+00    5.00e+00    5.00e+00   -3.50e-07
*   Vbs:        -2.00e-07    0.00e+00    0.00e+00   -3.50e-07   -3.50e-07
*   Vth:         0.00e+00    0.00e+00    0.00e+00    0.00e+00    0.00e+00
*   Vdsat:       5.00e+00    0.00e+00    0.00e+00    0.00e+00    5.00e+00
*   Gm:          4.00e-12    0.00e+00    0.00e+00    0.00e+00    7.01e-12
*   Gds:         1.00e-04    0.00e+00    0.00e+00    0.00e+00    1.00e-04
*   Gmb:         0.00e+00    0.00e+00    0.00e+00    0.00e+00    0.00e+00
*   Cbd:         0.00e+00    0.00e+00    0.00e+00    0.00e+00    0.00e+00
*   Cbs:         0.00e+00    0.00e+00    0.00e+00    0.00e+00    0.00e+00
*   Cgsov:       0.00e+00    0.00e+00    0.00e+00    0.00e+00    0.00e+00
*   Cgdov:       0.00e+00    0.00e+00    0.00e+00    0.00e+00    0.00e+00
*   Cgbov:       0.00e+00    0.00e+00    0.00e+00    0.00e+00    0.00e+00
*   Cgs:         0.00e+00    0.00e+00    0.00e+00    0.00e+00    0.00e+00
*   Cgd:         0.00e+00    0.00e+00    0.00e+00    0.00e+00    0.00e+00
*   Cgb:         0.00e+00   -0.00e+00   -0.00e+00    0.00e+00    0.00e+00
*   Name:      m:x1:x3:11   m:x1:x3:8   m:x1:x3:9   m:x1:x3:6   m:x1:x3:3
*   Model:        nmos        nmos        nmos        nmos        nmos
*   Id:          1.00e-11    1.00e-11    1.00e-11   -2.00e-11    1.00e-11
*   Vgs:         0.00e+00    2.00e-07   -2.00e-07    5.00e+00    0.00e+00
*   Vds:         5.00e+00    5.00e+00    5.00e+00   -2.00e-07    5.00e+00
*   Vbs:         0.00e+00    0.00e+00   -2.00e-07   -2.00e-07    0.00e+00
*   Vth:         0.00e+00    0.00e+00    0.00e+00    0.00e+00    0.00e+00
*   Vdsat:       0.00e+00    2.00e-07    0.00e+00    5.00e+00    0.00e+00
*   Gm:          0.00e+00    4.00e-12    0.00e+00    4.00e-12    0.00e+00
*   Gds:         0.00e+00    0.00e+00    0.00e+00    1.00e-04    0.00e+00
*   Gmb:         0.00e+00    0.00e+00    0.00e+00    0.00e+00    0.00e+00
*   Cbd:         0.00e+00    0.00e+00    0.00e+00    0.00e+00    0.00e+00
*   Cbs:         0.00e+00    0.00e+00    0.00e+00    0.00e+00    0.00e+00
*   Cgsov:       0.00e+00    0.00e+00    0.00e+00    0.00e+00    0.00e+00
*   Cgdov:       0.00e+00    0.00e+00    0.00e+00    0.00e+00    0.00e+00
*   Cgbov:       0.00e+00    0.00e+00    0.00e+00    0.00e+00    0.00e+00
*   Cgs:         0.00e+00    0.00e+00    0.00e+00    0.00e+00    0.00e+00
*   Cgd:         0.00e+00    0.00e+00    0.00e+00    0.00e+00    0.00e+00
*   Cgb:        -0.00e+00    0.00e+00    0.00e+00    0.00e+00   -0.00e+00
*   Name:       m:x1:x3:1  m:x1:x2:x7:6 m:x1:x2:x7:4 m:x1:x2:x7:2 m:x1:x2:x6:6
*   Model:        nmos         nmos         nmos         nmos         nmos
*   Id:          1.00e-11    1.00e-11     1.00e-11    -2.00e-11     1.00e-11
*   Vgs:         0.00e+00    0.00e+00    -1.25e-06     5.00e+00     0.00e+00
*   Vds:         5.00e+00    5.00e+00     5.00e+00    -2.00e-07     5.00e+00
*   Vbs:         0.00e+00    0.00e+00    -1.25e-06    -1.25e-06     0.00e+00
*   Vth:         0.00e+00    0.00e+00     0.00e+00     0.00e+00     0.00e+00
*   Vdsat:       0.00e+00    0.00e+00     0.00e+00     5.00e+00     0.00e+00
*   Gm:          0.00e+00    0.00e+00     0.00e+00     4.00e-12     0.00e+00
*   Gds:         0.00e+00    0.00e+00     0.00e+00     1.00e-04     0.00e+00
*   Gmb:         0.00e+00    0.00e+00     0.00e+00     0.00e+00     0.00e+00
*   Cbd:         0.00e+00    0.00e+00     0.00e+00     0.00e+00     0.00e+00
*   Cbs:         0.00e+00    0.00e+00     0.00e+00     0.00e+00     0.00e+00
*   Cgsov:       0.00e+00    0.00e+00     0.00e+00     0.00e+00     0.00e+00
*   Cgdov:       0.00e+00    0.00e+00     0.00e+00     0.00e+00     0.00e+00
*   Cgbov:       0.00e+00    0.00e+00     0.00e+00     0.00e+00     0.00e+00
*   Cgs:         0.00e+00    0.00e+00     0.00e+00     0.00e+00     0.00e+00
*   Cgd:         0.00e+00    0.00e+00     0.00e+00     0.00e+00     0.00e+00
*   Cgb:        -0.00e+00   -0.00e+00     0.00e+00     0.00e+00    -0.00e+00
*   Name:      m:x1:x2:x6:4 m:x1:x2:x6:2 m:x1:x2:x5:6 m:x1:x2:x5:4 m:x1:x2:x5:2
*   Model:         nmos         nmos         nmos         nmos         nmos
*   Id:         -9.22e-20    -1.00e-11     1.00e-11    -9.22e-20    -1.00e-11
*   Vgs:        -4.51e-07     5.00e+00     0.00e+00    -4.51e-07     5.00e+00
*   Vds:        -3.00e-07    -1.00e-07     5.00e+00    -3.00e-07    -1.00e-07
*   Vbs:        -4.51e-07    -4.51e-07     0.00e+00    -4.51e-07    -4.51e-07
*   Vth:         0.00e+00     0.00e+00     0.00e+00     0.00e+00     0.00e+00
*   Vdsat:       0.00e+00     5.00e+00     0.00e+00     0.00e+00     5.00e+00
*   Gm:          0.00e+00     2.00e-12     0.00e+00     0.00e+00     2.00e-12
*   Gds:         0.00e+00     1.00e-04     0.00e+00     0.00e+00     1.00e-04
*   Gmb:         0.00e+00     0.00e+00     0.00e+00     0.00e+00     0.00e+00
*   Cbd:         0.00e+00     0.00e+00     0.00e+00     0.00e+00     0.00e+00
*   Cbs:         0.00e+00     0.00e+00     0.00e+00     0.00e+00     0.00e+00
*   Cgsov:       0.00e+00     0.00e+00     0.00e+00     0.00e+00     0.00e+00
*   Cgdov:       0.00e+00     0.00e+00     0.00e+00     0.00e+00     0.00e+00
*   Cgbov:       0.00e+00     0.00e+00     0.00e+00     0.00e+00     0.00e+00
*   Cgs:         0.00e+00     0.00e+00     0.00e+00     0.00e+00     0.00e+00
*   Cgd:         0.00e+00     0.00e+00     0.00e+00     0.00e+00     0.00e+00